# EAGLE schematic Shemachinerough (EAGLE 6.1)
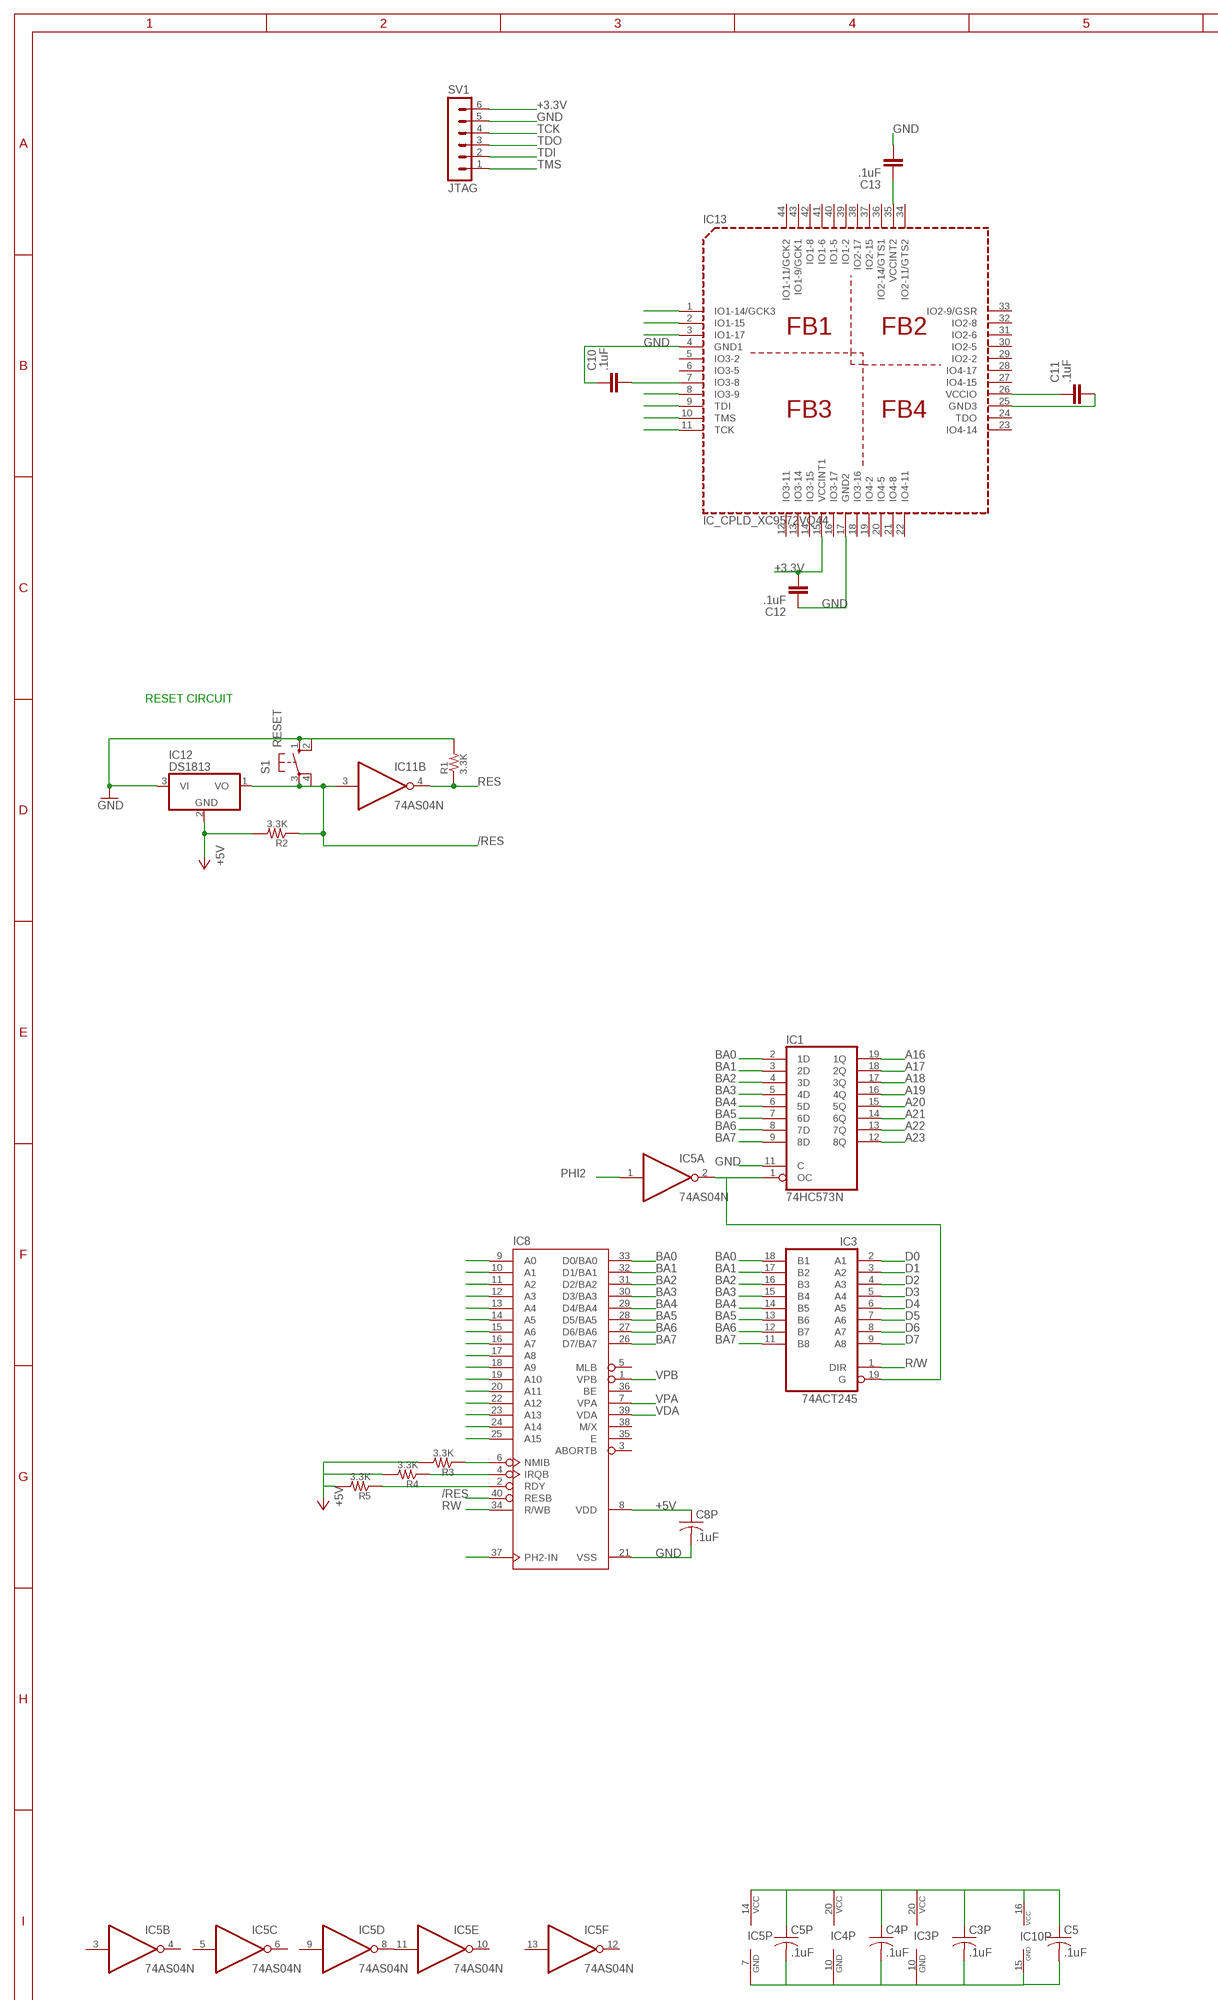
[diagram p0: schematic, sheet 1, part 1 of 3]
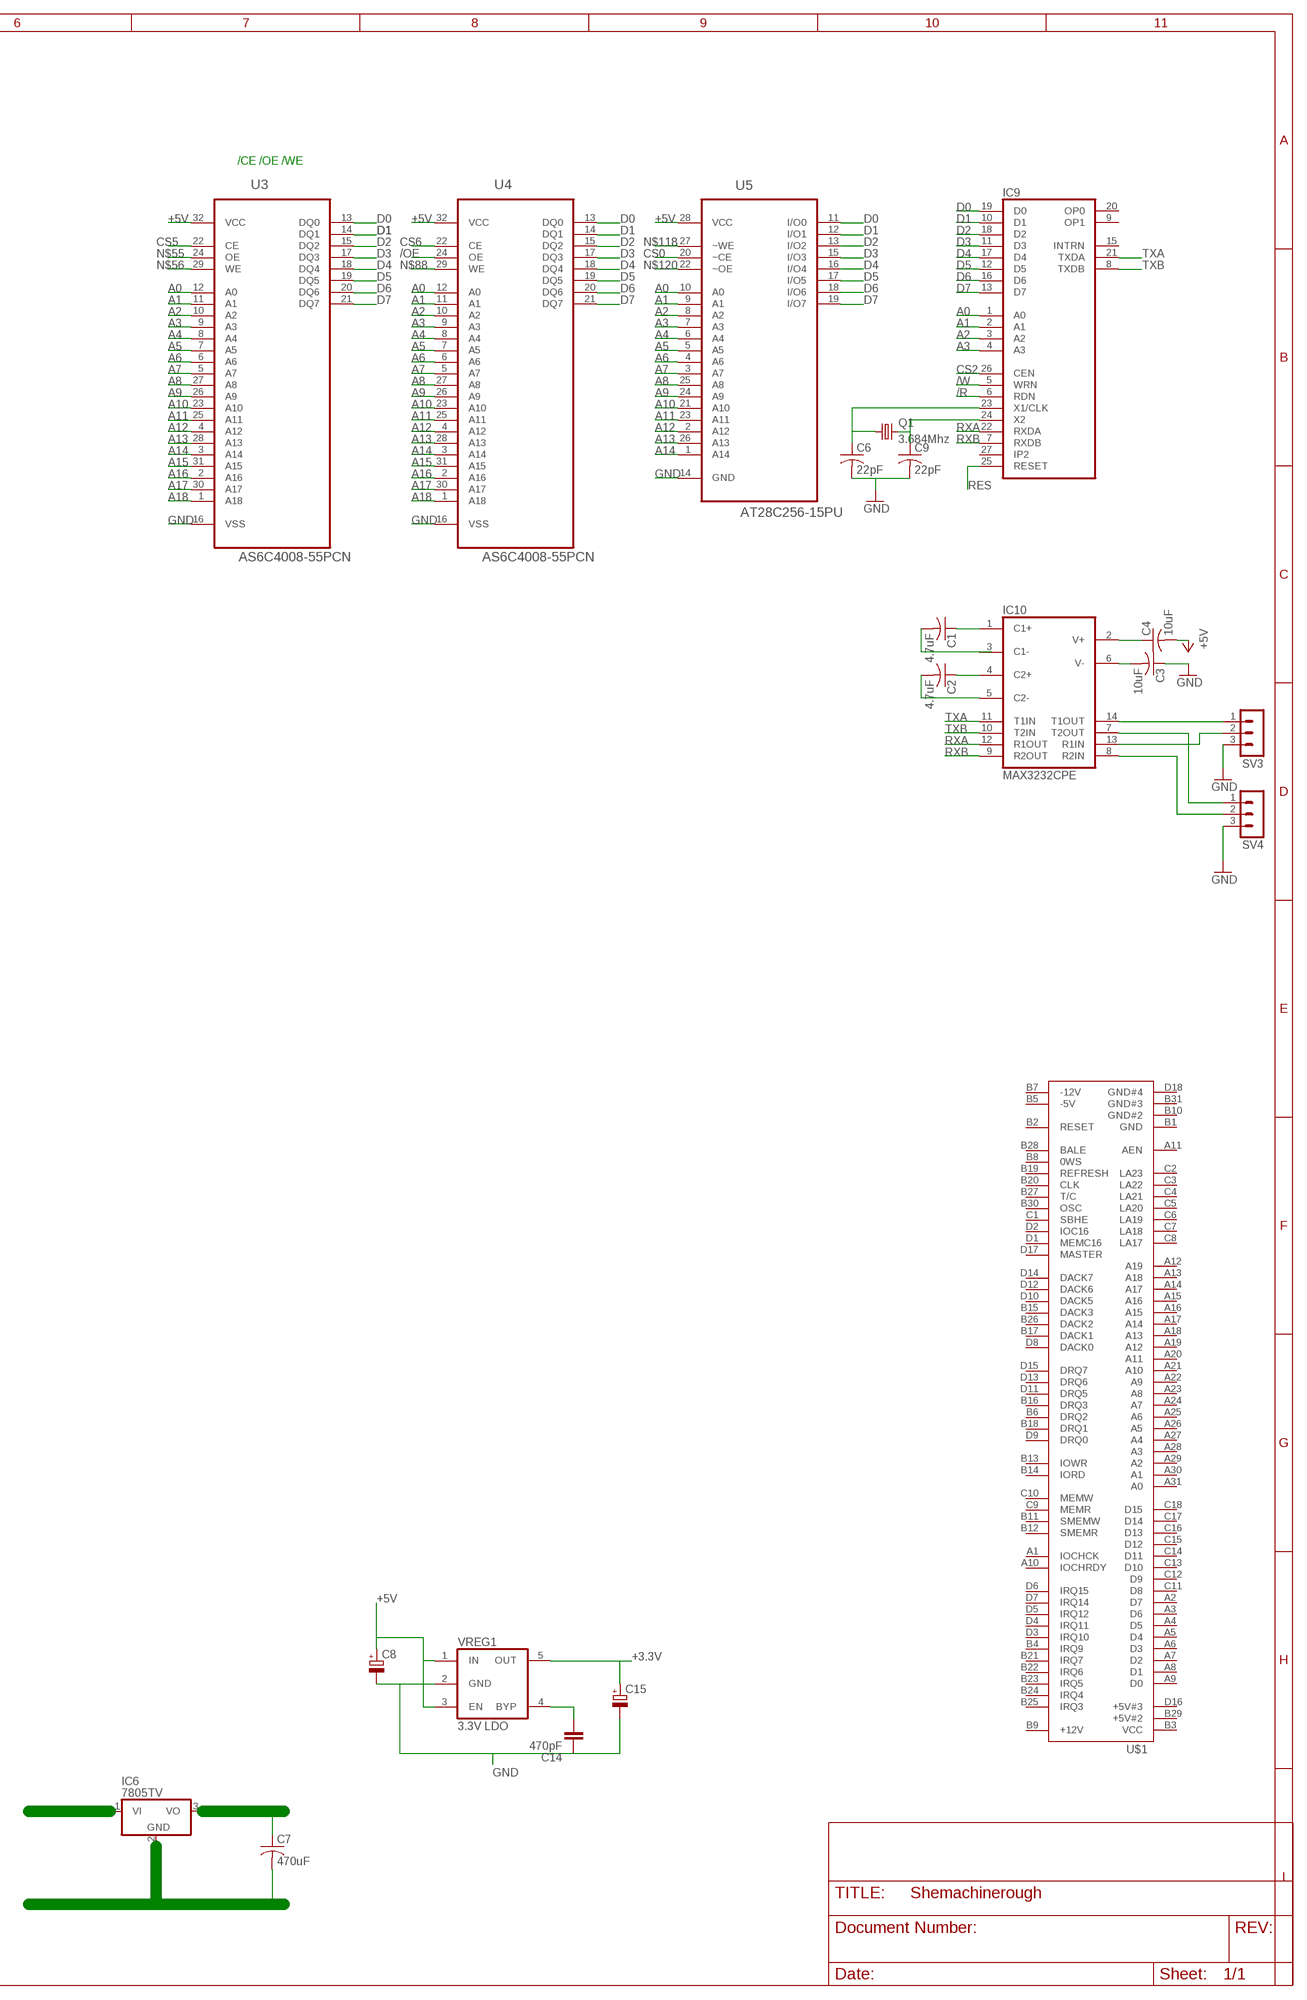
[diagram p1: schematic, sheet 1, part 2 of 3]
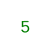
[diagram p2: schematic, sheet 1, part 3 of 3]

## Parts
C1  4.7uF  C-US025-030X050  [C025-030X050]
C2  4.7uF  C-US025-030X050  [C025-030X050]
C3  10uF  C-US025-030X050  [C025-030X050]
C3P  .1uF  C-US025-030X050  [C025-030X050]
C4  10uF  C-US025-030X050  [C025-030X050]
C4P  .1uF  C-US025-030X050  [C025-030X050]
C5  .1uF  C-US025-030X050  [C025-030X050]
C5P  .1uF  C-US025-030X050  [C025-030X050]
C6  22pF  C-US025-024X044  [C025-024X044]
C7  470uF  C-US050-050X075  [C050-050X075]
C8  CAPACITOR_POL-SMC_A  [SMC_A]
C8P  .1uF  C-US025-030X050  [C025-030X050]
C9  22pF  C-US025-024X044  [C025-024X044]
C10  .1uF  CAPACITOR_NPOL-0603  [C603]
C11  .1uF  CAPACITOR_NPOL-0603  [C603]
C12  .1uF  CAPACITOR_NPOL-0603  [C603]
C13  .1uF  CAPACITOR_NPOL-0603  [C603]
C14  470pF  CAPACITOR_NPOL-0603  [C603]
C15  CAPACITOR_POL-SMC_A  [SMC_A]
IC1  74HC573N  [DIL20]
IC3  74ACT245  74LS245N  [DIL20]
IC4  74ACT373  74LS373N  [DIL20]
IC5  74AS04N  [DIL14]
IC6  7805TV  [TO220V]
IC8  W65C816SP  [DIP-40]
IC9  XR-88C681SP  [DIL28-6]
IC10  MAX3232CPE  [DIL16]
IC11  74AS04N  [DIL14]
IC12  DS1813  78L05Z  [TO92]
IC13  IC_CPLD_XC9572VQ44  [VQ-44]
Q1  3.684Mhz  CRYSTALHC18U-V  [HC18U-V]
R1  3.3K  R-1/4W-02.54-V  [1/4W-2.54V]
R2  3.3K  R-1/4W-02.54-V  [1/4W-2.54V]
R3  3.3K  R-1/4W-02.54-V  [1/4W-2.54V]
R4  3.3K  R-1/4W-02.54-V  [1/4W-2.54V]
R5  3.3K  R-1/4W-02.54-V  [1/4W-2.54V]
S1  RESET  40-XX-ROUND  [B3F-40XX-ROUND]
SV1  JTAG  MA06-1  [MA06-1]
SV3  MA03-1  [MA03-1]
SV4  MA03-1  [MA03-1]
U3  AS6C4008-55PCN  [DIP254P1524X393-32]
U4  AS6C4008-55PCN  [DIP254P1524X393-32]
U5  AT28C256-15PU  [DIP254P1524X482-28]
U$1  ISA16-EDGE  [ISA16-EDGE]
VREG1  3.3V LDO  VREG_5PINS-SOT-23-5  [SOT-23-5]

## Nets
+3.3V: C12.2 C15.+ IC13.15(VCCINT1) SV1.6 VREG1.5(OUT)
+5V: C3P.1 C4.2 C4P.1 C5.1 C5P.1 C7.1 C8.+ C8P.1 IC3.20(VCC) IC4.20(VCC) IC5.14(P:VCC) IC6.3(VO) IC8.8(VDD) IC10.16(VCC) IC12.2(GND) U3.32(VCC) U4.32(VCC) U5.28(VCC) VREG1.1(IN) VREG1.3(EN)
+V: IC6.1(VI)
/OE: U4.24(OE)
/R: IC9.6(RDN)
/RES: IC8.40(RESB) IC11.3(B:I) IC12.1(VO) S1.3(P) S1.4(P1)
/W: IC9.5(WRN)
A0: IC8.9(A0) IC9.1(A0) U3.12(A0) U4.12(A0) U5.10(A0)
A1: IC8.10(A1) IC9.2(A1) U3.11(A1) U4.11(A1) U5.9(A1)
A2: IC8.11(A2) IC9.3(A2) U3.10(A2) U4.10(A2) U5.8(A2)
A3: IC8.12(A3) IC9.4(A3) U3.9(A3) U4.9(A3) U5.7(A3)
A4: IC8.13(A4) U3.8(A4) U4.8(A4) U5.6(A4)
A5: IC8.14(A5) U3.7(A5) U4.7(A5) U5.5(A5)
A6: IC8.15(A6) U3.6(A6) U4.6(A6) U5.4(A6)
A7: IC8.16(A7) U3.5(A7) U4.5(A7) U5.3(A7)
A8: IC8.17(A8) U3.27(A8) U4.27(A8) U5.25(A8)
A9: IC8.18(A9) U3.26(A9) U4.26(A9) U5.24(A9)
A10: IC8.19(A10) U3.23(A10) U4.23(A10) U5.21(A10)
A11: IC8.20(A11) U3.25(A11) U4.25(A11) U5.23(A11)
A12: IC8.22(A12) U3.4(A12) U4.4(A12) U5.2(A12)
A13: IC8.23(A13) U3.28(A13) U4.28(A13) U5.26(A13)
A14: IC8.24(A14) U3.3(A14) U4.3(A14) U5.1(A14)
A15: IC8.25(A15) U3.31(A15) U4.31(A15)
A16: IC1.19(1Q) U3.2(A16) U4.2(A16)
A17: IC1.18(2Q) U3.30(A17) U4.30(A17)
A18: IC1.17(3Q) U3.1(A18) U4.1(A18)
A19: IC1.16(4Q)
A20: IC1.15(5Q)
A21: IC1.14(6Q)
A22: IC1.13(7Q)
A23: IC1.12(8Q)
BA0: IC1.2(1D) IC3.18(B1) IC8.33(D0/BA0)
BA1: IC1.3(2D) IC3.17(B2) IC8.32(D1/BA1)
BA2: IC1.4(3D) IC3.16(B3) IC8.31(D2/BA2)
BA3: IC1.5(4D) IC3.15(B4) IC8.30(D3/BA3)
BA4: IC1.6(5D) IC3.14(B5) IC8.29(D4/BA4)
BA5: IC1.7(6D) IC3.13(B6) IC8.28(D5/BA5)
BA6: IC1.8(7D) IC3.12(B7) IC8.27(D6/BA6)
BA7: IC1.9(8D) IC3.11(B8) IC8.26(D7/BA7)
CS0: U5.20(~CE)
CS2: IC9.26(CEN)
CS5: U3.22(CE)
CS6: U4.22(CE)
D0: IC3.2(A1) IC9.19(D0) U3.13(DQ0) U4.13(DQ0) U5.11(I/O0)
D1: IC3.3(A2) IC9.10(D1) U3.14(DQ1) U4.14(DQ1) U5.12(I/O1)
D2: IC3.4(A3) IC9.18(D2) U3.15(DQ2) U4.15(DQ2) U5.13(I/O2)
D3: IC3.5(A4) IC9.11(D3) U3.17(DQ3) U4.17(DQ3) U5.15(I/O3)
D4: IC3.6(A5) IC9.17(D4) U3.18(DQ4) U4.18(DQ4) U5.16(I/O4)
D5: IC3.7(A6) IC9.12(D5) U3.19(DQ5) U4.19(DQ5) U5.17(I/O5)
D6: IC3.8(A7) IC9.16(D6) U3.20(DQ6) U4.20(DQ6) U5.18(I/O6)
D7: IC3.9(A8) IC9.13(D7) U3.21(DQ7) U4.21(DQ7) U5.19(I/O7)
GND: C3.1 C3P.2 C4P.2 C5.2 C5P.2 C6.2 C7.2 C8.- C8P.2 C9.2 C10.1 C12.1 C13.2 C14.1 C15.- IC1.11(C) IC3.10(GND) IC4.10(GND) IC5.7(P:GND) IC6.2(GND) IC8.21(VSS) IC10.15(GND) IC12.3(VI) IC13.4(GND1) IC13.17(GND2) S1.1(S) S1.2(S1) SV1.5 SV3.3 SV4.3 U3.16(VSS) U4.16(VSS) U5.14(GND) VREG1.2(GND)
N$1: C11.2 IC13.25(GND3)
N$2: C11.1 IC13.26(VCCIO)
N$3: C13.1 IC13.35(VCCINT2)
N$4: IC8.6(NMIB)
N$5: C10.2 IC13.7(IO3-8)
N$6: IC13.8(IO3-9)
N$7: IC13.3(IO1-17)
N$8: IC5.8(D:O) IC5.11(E:I)
N$9: IC1.1(OC) IC3.19(G) IC5.2(A:O)
N$10: IC8.4(IRQB)
N$11: IC8.2(RDY)
N$12: C14.2 VREG1.4(BYP)
N$13: IC13.2(IO1-15)
N$14: IC13.1(IO1-14/GCK3)
N$20: C2.1 IC10.4(C2+)
N$21: C2.2 IC10.5(C2-)
N$22: C1.2
N$23: C1.1 IC10.1(C1+)
N$24: C4.1 IC10.2(V+)
N$25: C6.1 IC9.23(X1/CLK) Q1.1
N$26: C9.1 IC9.24(X2) Q1.2
N$27: C3.2 IC10.6(V-)
N$55: U3.24(OE)
N$56: U3.29(WE)
N$88: U4.29(WE)
N$118: U5.27(~WE)
N$120: U5.22(~OE)
PHI2: IC5.1(A:I) IC8.37(PH2-IN)
R/W: IC3.1(DIR)
RES: IC9.25(RESET) IC11.4(B:O)
RW: IC8.34(R/WB)
RX232A: IC10.13(R1IN) SV3.2
RX232B: IC10.8(R2IN) SV4.2
RXA: IC9.22(RXDA) IC10.12(R1OUT)
RXB: IC9.7(RXDB) IC10.9(R2OUT)
TCK: IC13.11(TCK) SV1.4
TDI: IC13.9(TDI) SV1.2
TDO: SV1.3
TMS: IC13.10(TMS) SV1.1
TX232A: IC10.14(T1OUT) SV3.1
TX232B: IC10.7(T2OUT) SV4.1
TXA: IC9.21(TXDA) IC10.11(T1IN)
TXB: IC9.8(TXDB) IC10.10(T2IN)
VDA: IC8.39(VDA)
VPA: IC8.7(VPA)
VPB: IC8.1(VPB)
Unconnected: IC4.1(OC) IC4.2(1Q) IC4.3(1D) IC4.4(2D) IC4.5(2Q) IC4.6(3Q) IC4.7(3D) IC4.8(4D) IC4.9(4Q) IC4.11(ENC) IC4.12(5Q) IC4.13(5D) IC4.14(6D) IC4.15(6Q) IC4.16(7Q) IC4.17(7D) IC4.18(8D) IC4.19(8Q) IC5.3(B:I) IC5.4(B:O) IC5.5(C:I) IC5.6(C:O) IC5.9(D:I) IC5.10(E:O) IC5.12(F:O) IC5.13(F:I) IC8.3(ABORTB) IC8.5(MLB) IC8.35(E) IC8.36(BE) IC8.38(M/X) IC9.9(OP1) IC9.15(INTRN) IC9.20(OP0) IC9.27(IP2) IC10.3(C1-) IC11.1(A:I) IC11.2(A:O) IC11.5(C:I) IC11.6(C:O) IC11.8(D:O) IC11.9(D:I) IC11.10(E:O) IC11.11(E:I) IC11.12(F:O) IC11.13(F:I) IC13.5(IO3-2) IC13.6(IO3-5) IC13.12(IO3-11) IC13.13(IO3-14) IC13.14(IO3-15) IC13.16(IO3-17) IC13.18(IO3-16) IC13.19(IO4-2) IC13.20(IO4-5) IC13.21(IO4-8) IC13.22(IO4-11) IC13.23(IO4-14) IC13.24(TDO) IC13.27(IO4-15) IC13.28(IO4-17) IC13.29(IO2-2) IC13.30(IO2-5) IC13.31(IO2-6) IC13.32(IO2-8) IC13.33(IO2-9/GSR) IC13.34(IO2-11/GTS2) IC13.36(IO2-14/GTS1) IC13.37(IO2-15) IC13.38(IO2-17) IC13.39(IO1-2) IC13.40(IO1-5) IC13.41(IO1-6) IC13.42(IO1-8) IC13.43(IO1-9/GCK1) IC13.44(IO1-11/GCK2) R1.PAD1(PIN1) R1.PAD2(PIN2) R2.PAD1(PIN1) R2.PAD2(PIN2) R3.PAD1(PIN1) R3.PAD2(PIN2) R4.PAD1(PIN1) R4.PAD2(PIN2) R5.PAD1(PIN1) R5.PAD2(PIN2) U$1.A1(IOCHCK) U$1.A2(D7) U$1.A3(D6) U$1.A4(D5) U$1.A5(D4) U$1.A6(D3) U$1.A7(D2) U$1.A8(D1) U$1.A9(D0) U$1.A10(IOCHRDY) U$1.A11(AEN) U$1.A12(A19) U$1.A13(A18) U$1.A14(A17) U$1.A15(A16) U$1.A16(A15) U$1.A17(A14) U$1.A18(A13) U$1.A19(A12) U$1.A20(A11) U$1.A21(A10) U$1.A22(A9) U$1.A23(A8) U$1.A24(A7) U$1.A25(A6) U$1.A26(A5) U$1.A27(A4) U$1.A28(A3) U$1.A29(A2) U$1.A30(A1) U$1.A31(A0) U$1.B1(GND) U$1.B2(RESET) U$1.B3(VCC) U$1.B4(IRQ9) U$1.B5(-5V) U$1.B6(DRQ2) U$1.B7(-12V) U$1.B8(0WS) U$1.B9(+12V) U$1.B10(GND#2) U$1.B11(SMEMW) U$1.B12(SMEMR) U$1.B13(IOWR) U$1.B14(IORD) U$1.B15(DACK3) U$1.B16(DRQ3) U$1.B17(DACK1) U$1.B18(DRQ1) U$1.B19(REFRESH) U$1.B20(CLK) U$1.B21(IRQ7) U$1.B22(IRQ6) U$1.B23(IRQ5) U$1.B24(IRQ4) U$1.B25(IRQ3) U$1.B26(DACK2) U$1.B27(T/C) U$1.B28(BALE) U$1.B29(+5V#2) U$1.B30(OSC) U$1.B31(GND#3) U$1.C1(SBHE) U$1.C2(LA23) U$1.C3(LA22) U$1.C4(LA21) U$1.C5(LA20) U$1.C6(LA19) U$1.C7(LA18) U$1.C8(LA17) U$1.C9(MEMR) U$1.C10(MEMW) U$1.C11(D8) U$1.C12(D9) U$1.C13(D10) U$1.C14(D11) U$1.C15(D12) U$1.C16(D13) U$1.C17(D14) U$1.C18(D15) U$1.D1(MEMC16) U$1.D2(IOC16) U$1.D3(IRQ10) U$1.D4(IRQ11) U$1.D5(IRQ12) U$1.D6(IRQ15) U$1.D7(IRQ14) U$1.D8(DACK0) U$1.D9(DRQ0) U$1.D10(DACK5) U$1.D11(DRQ5) U$1.D12(DACK6) U$1.D13(DRQ6) U$1.D14(DACK7) U$1.D15(DRQ7) U$1.D16(+5V#3) U$1.D17(MASTER) U$1.D18(GND#4)

## Notes on the sheet
- /CE /OE /WE
- RESET CIRCUIT
- 5

## Power pins joined to a net without a drawn wire
GND: IC1.10(GND) IC9.14(GND) IC11.7(P:GND)
VCC: IC1.20(VCC) IC9.28(VCC) IC11.14(P:VCC)

## Library data of the parts
C1-C3 C3P C4 C4P C5 C5P C6 C7 C8P C9 = rcl:C-US: CAPACITOR, American symbol
C8 C15 = dp_devices:CAPACITOR_POL: Polarized capacitor in various packages
C10-C14 = dp_devices:CAPACITOR_NPOL: Non-Polarized capacitor in various packages
IC1 = 74xx-us:74*573: 8-bit D latch BUS DRIVER
IC3 = 74xx-us:74*245: Octal BUS TRANSCEIVER, 3-state
IC4 = 74xx-us:74*373: Octal D type transparent LATCH, edge triggered
IC5 IC11 = 74xx-us:74*04: Hex INVERTER
IC6 = linear:78*: Positive VOLTAGE REGULATOR Source: http://cache.national.com/ds/LM/LM78L05.pdf http://www.fairchildsemi.com/ds/LM/LM7805.pdf
IC8 = 65xxx:W65C816SP: Wetern Digital Version
IC9 = exar:XR-88C681SP: DUAL UART full duplex; MPN: XR88C681CP/40-F; OC_FARNELL: 1095818; OC_NEWARK: 53R0425
IC10 = maxim:MAX3232*: True RS-232 Transceivers 3.0V to 5.5V, Low-Power up to 1Mbps, Using Four 0.1µF External Capacitors Source: http://pdfserv.maxim-ic.com/en/ds/MAX3222-MAX3241.pdf; MF: MAXIM; MPN: MAX3232CPE+; OC_FARNELL: 9724494; OC_NEWARK: 68K4626
IC12 = adafruit:78*: Positive VOLTAGE REGULATOR Added bigger pads to the TO-92 package
IC13 = dp_devices:IC_CPLD_XC9572
Q1 = adafruit:CRYSTAL: CRYSTAL; OC_FARNELL: unknown; OC_NEWARK: unknown
R1-R5 = r-j:R-: RESISTOR Japanese symbol
S1 = adafruit:40-XX: OMRON SWITCH
SV1 = con-lstb:MA06-1: PIN HEADER; OC_FARNELL: unknown; OC_NEWARK: unknown
SV3 SV4 = con-lstb:MA03-1: PIN HEADER; OC_FARNELL: unknown; OC_NEWARK: unknown
U3 U4 = Alliance_Memory_By_element14_Batch_1:AS6C4008-55PCN: CMOS SRAM; MPN: AS6C4008-55PCN; OC_FARNELL: 1562900; OC_NEWARK: 94M6217; PACKAGE: DIP-32; SUPPLIER: ALLIANCE MEMORY
U5 = Atmel_By_element14_Batch_1-00:AT28C256-15PU: Paged Parallel EEPROM; DESCRIPTION: Paged Parallel EEPROM; MPN: AT28C256-15PU; OC_FARNELL: 1095782; OC_NEWARK: 96K6555; PACKAGE: PDIP-28; SUPPLIER: ATMEL
U$1 = 0RB_Connectors:ISA16-EDGE: 16 bits ISA bus edge connector
VREG1 = dp_devices:VREG_5PINS: 5 pins voltage regulator